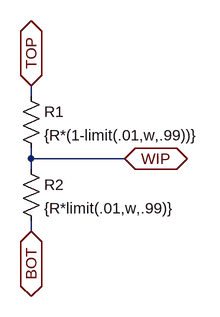
[diagram p0: schematic Pot.asc]
Pot.asc, the LTspice schematic file:
Version 4
SHEET 1 880 680
WIRE 224 96 224 80
WIRE 224 192 224 176
WIRE 368 192 224 192
WIRE 224 208 224 192
WIRE 224 304 224 288
FLAG 224 80 TOP
IOPIN 224 80 BiDir
FLAG 224 304 BOT
IOPIN 224 304 BiDir
FLAG 368 192 WIP
IOPIN 368 192 BiDir
SYMBOL res 208 80 R0
SYMATTR InstName R1
SYMATTR Value {R*(1-limit(.01,w,.99))}
SYMBOL res 208 192 R0
SYMATTR InstName R2
SYMATTR Value {R*limit(.01,w,.99)}

The netlist it stands for:
* Pot.asc
R1 TOP WIP {R*(1-limit(.01,w,.99))}
R2 WIP BOT {R*limit(.01,w,.99)}
.backanno
.end